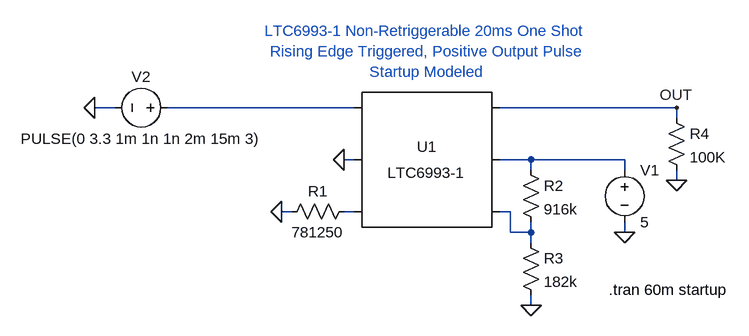
[diagram p0: schematic LTC6993-1 Monostable Vibrator Circuit.asc]
LTC6993-1 Monostable Vibrator Circuit.asc, the LTspice schematic file:
Version 4.1
SHEET 1 880 680
WIRE -272 96 -304 96
WIRE 96 96 -192 96
WIRE 592 96 320 96
WIRE 592 112 592 96
WIRE 96 176 80 176
WIRE 368 176 320 176
WIRE 512 176 368 176
WIRE 368 192 368 176
WIRE 512 192 512 176
WIRE 592 208 592 192
WIRE 0 256 -16 256
WIRE 96 256 80 256
WIRE 336 256 320 256
WIRE 336 288 336 256
WIRE 368 288 368 272
WIRE 368 288 336 288
WIRE 512 288 512 272
WIRE 368 304 368 288
WIRE 368 400 368 384
FLAG -304 96 0
FLAG 512 288 0
FLAG 592 96 OUT
FLAG -16 256 0
FLAG 368 400 0
FLAG 592 208 0
FLAG 80 176 0
SYMBOL res 96 240 R90
WINDOW 0 0 56 VBottom 2
WINDOW 3 32 56 VTop 2
SYMATTR InstName R1
SYMATTR Value 781250
SYMBOL res 352 176 R0
SYMATTR InstName R2
SYMATTR Value 916k
SYMBOL res 352 288 R0
SYMATTR InstName R3
SYMATTR Value 182k
SYMBOL res 576 96 R0
SYMATTR InstName R4
SYMATTR Value 100K
SYMBOL voltage 512 176 R0
WINDOW 123 0 0 Left 2
WINDOW 39 0 0 Left 2
SYMATTR InstName V1
SYMATTR Value 5
SYMBOL voltage -176 96 R90
WINDOW 123 74 56 VTop 2
WINDOW 39 53 56 VTop 2
WINDOW 3 32 56 VTop 2
WINDOW 0 -32 56 VBottom 2
SYMATTR Value PULSE(0 3.3 1m 1n 1n 2m 15m 3)
SYMATTR InstName V2
SYMBOL SpecialFunctions\\LTC6993-1 208 176 R0
SYMATTR InstName U1
TEXT 488 376 Left 2 !.tran 60m startup
TEXT 208 56 Bottom 2 ;LTC6993-1 Non-Retriggerable 20ms One Shot\nRising Edge Triggered, Positive Output Pulse\nStartup Modeled

The netlist it stands for:
* LTC6993-1 Monostable Vibrator Circuit.asc
R1 N003 0 781250
R2 N002 N004 916k
R3 N004 0 182k
R4 OUT 0 100K
V1 N002 0 5
V2 N001 0 PULSE(0 3.3 1m 1n 1n 2m 15m 3)
X§U1 N001 0 N003 N004 N002 OUT LTC6993-1
.tran 60m startup
* LTC6993-1 Non-Retriggerable 20ms One Shot
* Rising Edge Triggered, Positive Output Pulse
* Startup Modeled
.backanno
.end